# Altium schematic sheet GPS.SchDoc: GPS (SAM-M8Q) circuit
size A4; Revision: 1-1; SheetNumber: 5; SheetTotal: 6
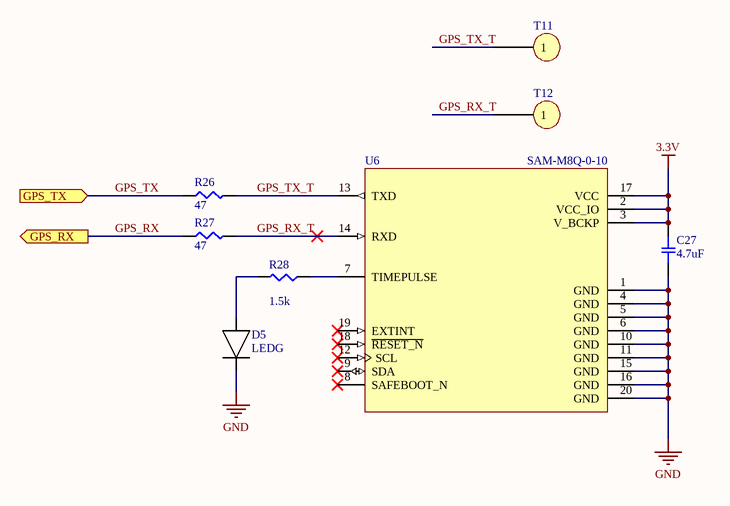
[diagram p0: GPS.SchDoc]

## Parts
C27  value 4.7uF  [0603-CAP]  (hidden comment: 0603C 4U7F)
D5  LEDG  [0603-LED]
R26  value 47  [0603-RES]  (hidden comment: 0603R 47R)
R27  value 47  [0603-RES]  (hidden comment: 0603R 47R)
R28  value 1.5k  [0603-RES]  (hidden comment: 0603R 1K5R)
T11  *  [1_PIN_test]  (value not drawn)
T12  *  [1_PIN_test]  (value not drawn)
U6  SAM-M8Q-0-10  [SAMM8Q010]

## Ports
GPS_RX (out), GPS_TX (in)

## Nets
3.3V: C27.1 U6.2(VCC_IO) U6.3(V_BCKP) U6.17(VCC)
GND: C27.2 D5.2 U6.1(GND) U6.4(GND) U6.5(GND) U6.6(GND) U6.10(GND) U6.11(GND) U6.15(GND) U6.16(GND) U6.20(GND)
GPS_RX: R27.1 ; port GPS_RX
GPS_RX_T: R27.2 T12.1 U6.14(RXD)
GPS_TX: R26.1 ; port GPS_TX
GPS_TX_T: R26.2 T11.1 U6.13(TXD)
NetD5_1: D5.1 R28.2
NetR28_1: R28.1 U6.7(TIMEPULSE)

Not connected (* = marked no-connect by the designer): U6 8(SAFEBOOT_N)* 9(SDA)* 12(SCL)* 18(~{RESET_N})* 19(EXTINT)*

## Notes on the sheet
- Title
- Size:
- Date:
- A4
- Number:
- Time:
- Revision:
- Sheet
- of
- File:

## Library data of the parts
D5 = 0603 LEDG: Supplier 1: Digi-Key; Supplier Part Number 1: 160-1183-6-ND; Value: LEDG
T11 T12 = 1pin_header
U6 = SAM-M8Q-0-10: CAM-M8 RF Receiver BeiDou, GLONASS, GNSS, GPS 1.575GHz -167dBm On-Board, Chip Module; MF: U-Blox America; SnapEDA_Link: https://www.snapeda.com/parts/SAM-M8Q-0-10/U-Blox%20America/view-part/?ref=search&t=SAM-M8Q-0-10; MP: SAM-M8Q-0-10; Package: 20-SMD Module; Digi-Key_Part_Number: 672-1054-1-ND; Digi-Key_Purchase_URL: https://www.digikey.com/product-detail/en/u-blox-america-inc/SAM-M8Q-0-10/672-1054-1-ND/7393573; Value: *; datasheet link: https://www.u-blox.com/sites/default/files/SAM-M8Q_HardwareIntegrationManual_%28UBX-16018358%29.pdf; Price: 25; Supplier 1: Digi-Key; Supplier Part Number 1: 672-1054-1-ND
C27 = 0603C 4U7F: Supplier 1: Digi-Key; Supplier Part Number 1: 399-3482-1-ND
R26 R27 = 0603R 47R: Package: 0603; Supplier 1: Digi-Key; Supplier Part Number 1: 311-47.0HRDKR-ND
R28 = 0603R 1K5R: Package: 0603; Supplier 1: Digi-Key; Supplier Part Number 1: 311-1.50KHRCT-ND